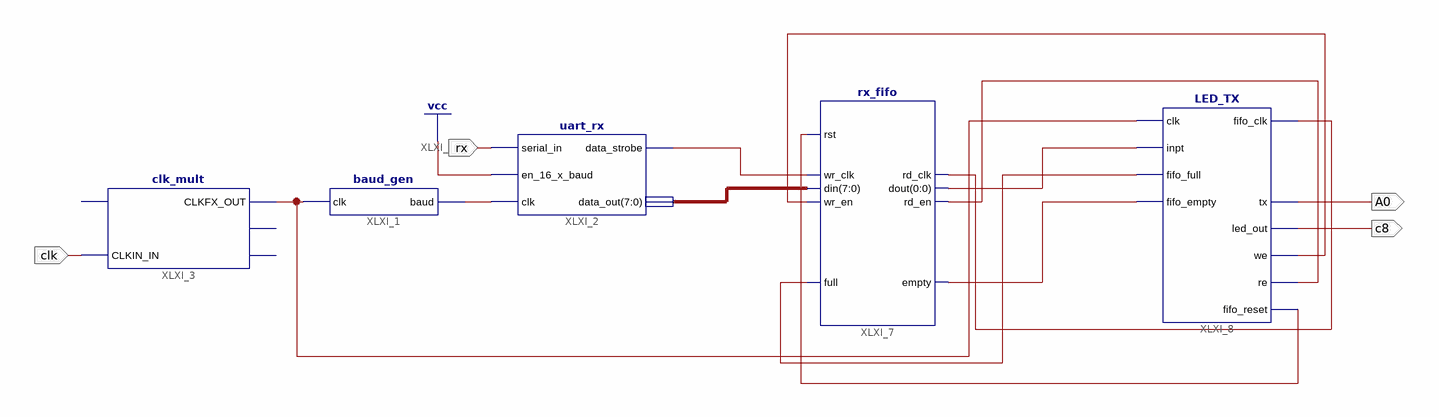
[diagram p0: schematic sheet 1]
// Xilinx ISE schematic main.sch (spartan3e) as structural Verilog: 5 symbols, 4 ports
module main (
  input  rx,
  input  clk,
  output c8,
  output A0
);

  wire XLXN_57, XLXN_59, XLXN_60, XLXN_61, XLXN_63, XLXN_66, XLXN_68, XLXN_70, XLXN_74;
  wire [0:0] XLXN_62;
  wire [7:0] XLXN_53;

  baud_gen XLXI_1 (.clk(XLXN_74), .baud(XLXN_68));
  uart_rx XLXI_2 (.serial_in(rx), .en_16_x_baud(1'b1), .clk(XLXN_68), .data_strobe(XLXN_70), .data_out(XLXN_53));
  clk_mult XLXI_3 (.CLKIN_IN(clk), .CLKFX_OUT(XLXN_74));  // open: RST_IN, CLKIN_IBUFG_OUT, CLK0_OUT
  rx_fifo XLXI_7 (
    .rst(XLXN_63), .wr_clk(XLXN_70), .din(XLXN_53), .wr_en(XLXN_66), .full(XLXN_61), .rd_clk(XLXN_57),
    .dout(XLXN_62[0]), .rd_en(XLXN_59), .empty(XLXN_60));
  LED_TX XLXI_8 (
    .clk(XLXN_74), .inpt(XLXN_62[0]), .fifo_full(XLXN_61), .fifo_empty(XLXN_60), .fifo_clk(XLXN_57),
    .we(XLXN_66), .re(XLXN_59), .led_out(c8), .tx(A0), .fifo_reset(XLXN_63));
endmodule
